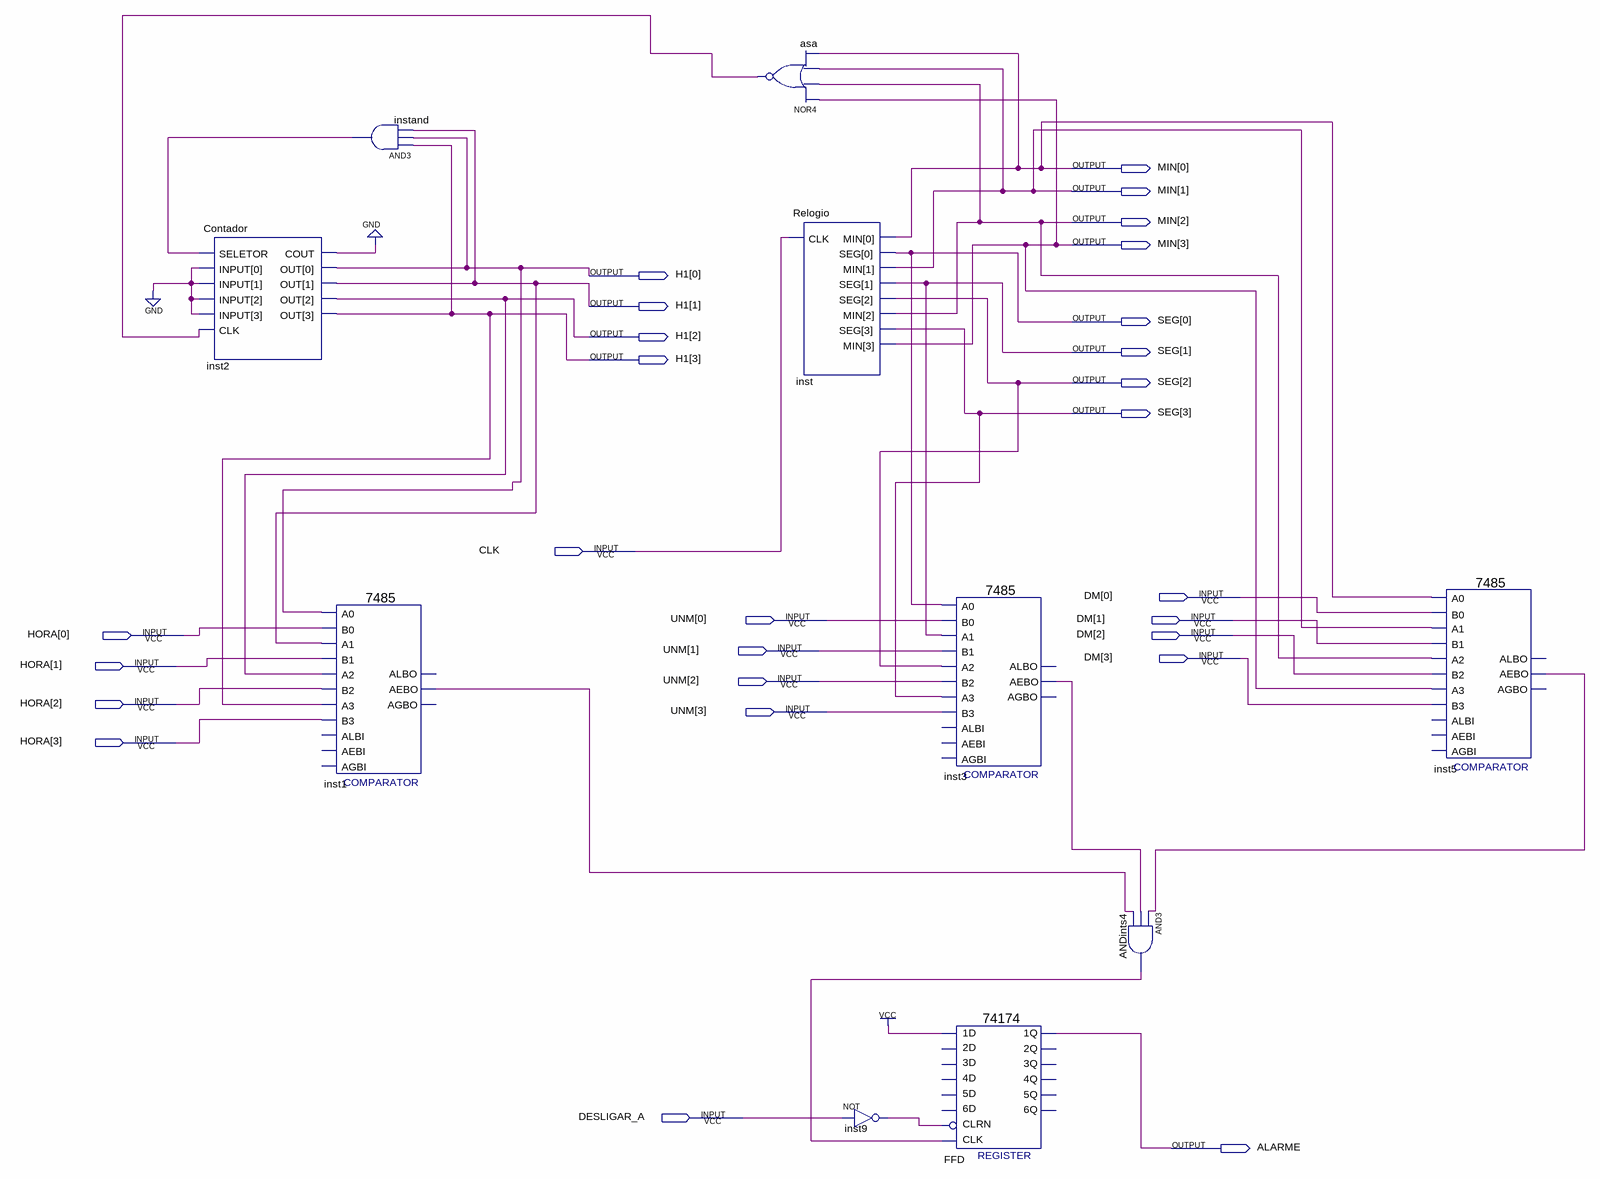
[diagram p0: schematic sheet]
// Quartus schematic FullRelogio.bdf as structural Verilog: 10 symbols, 27 pins
module FullRelogio (
  input  CLK,
  input  [3:0] DM,
  input  [3:0] UNM,
  input  [3:0] HORA,
  input  DESLIGAR_A,
  output [3:0] MIN,
  output [3:0] H1,
  output [3:0] SEG,
  output ALARME
);

  wire ANDints4_out, asa_out, inst1_aebo, inst2_cout, inst3_aebo, inst5_aebo, inst9_out, instand_out;

  Contador inst2 (.SELETOR(instand_out), .INPUT(4'b0000), .CLK(asa_out), .COUT(inst2_cout), .OUT(H1));
  \7485  inst1 (
    .A3(H1[3]), .B2(HORA[2]), .A2(H1[2]), .A0(H1[0]), .B0(HORA[0]), .B3(HORA[3]), .A1(H1[1]), .B1(HORA[1]),
    .AEBO(inst1_aebo));  // open: AEBI, AGBI, ALBI, ALBO, AGBO
  and instand (instand_out, H1[3], H1[0], H1[1]);
  nor asa (asa_out, MIN[3], MIN[2], MIN[1], MIN[0]);
  Relogio inst (.CLK(CLK), .MIN(MIN), .SEG(SEG));
  not inst9 (inst9_out, DESLIGAR_A);
  \7485  inst3 (
    .A3(SEG[3]), .B2(UNM[2]), .A2(SEG[2]), .A0(SEG[0]), .B0(UNM[0]), .B3(UNM[3]), .A1(SEG[1]), .B1(UNM[1]),
    .AEBO(inst3_aebo));  // open: AEBI, AGBI, ALBI, ALBO, AGBO
  \74174  FFD (
    .CLK(ANDints4_out), .CLRN(inst9_out), .\1D (1'b1), .\1Q (ALARME));  // open: 4D, 3D, 5D, 6D, 2D, 4Q, 3Q, 2Q, 6Q, 5Q
  and ANDints4 (ANDints4_out, inst5_aebo, inst3_aebo, inst1_aebo);
  \7485  inst5 (
    .A3(MIN[3]), .B2(DM[2]), .A2(MIN[2]), .A0(MIN[0]), .B0(DM[0]), .B3(DM[3]), .A1(MIN[1]), .B1(DM[1]),
    .AEBO(inst5_aebo));  // open: AEBI, AGBI, ALBI, ALBO, AGBO
  // also tied to GND on the sheet: inst2_cout
endmodule
